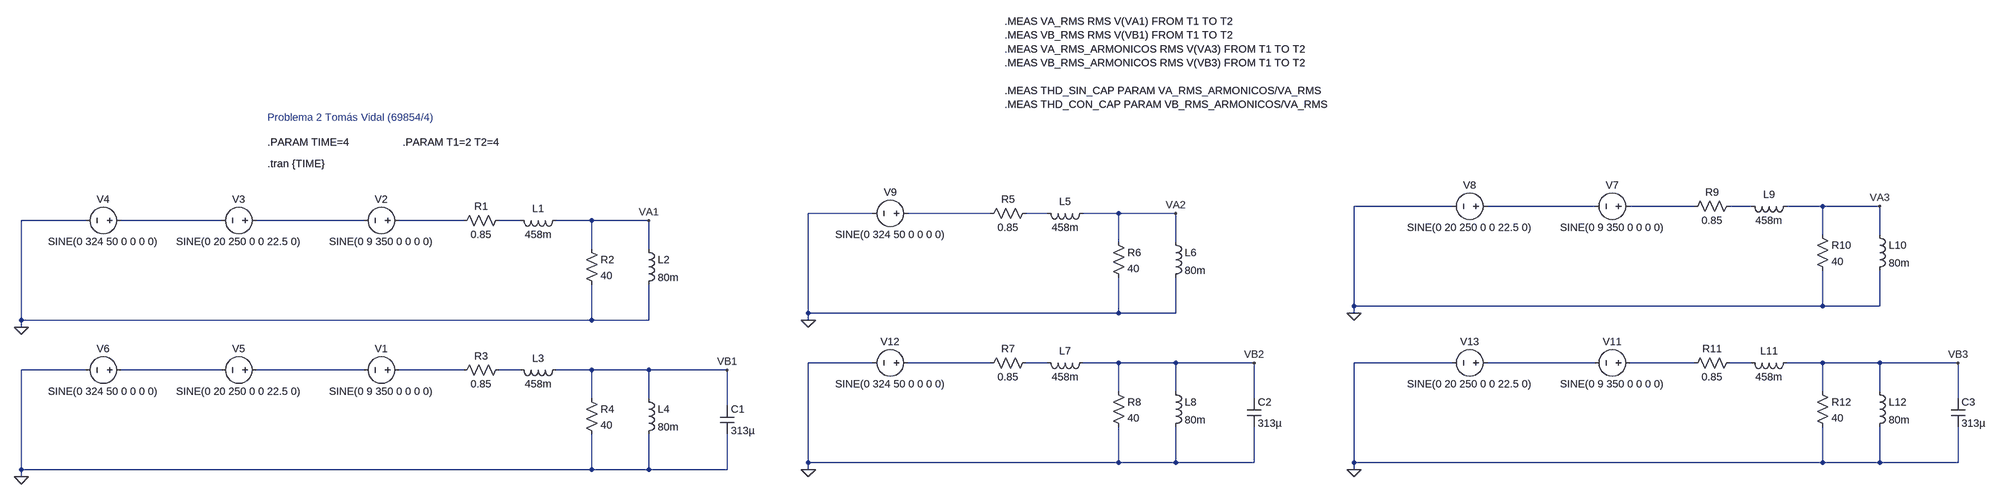
[diagram p0: schematic Problema2.asc]
Problema2.asc, the LTspice schematic file:
Version 4.1
SHEET 1 9112 6880
WIRE 3552 1152 3104 1152
WIRE 3872 1152 3632 1152
WIRE 4096 1152 3952 1152
WIRE 4224 1152 4176 1152
WIRE 4384 1152 4304 1152
WIRE 4512 1152 4384 1152
WIRE 1440 1168 1296 1168
WIRE 2288 1168 1520 1168
WIRE 2416 1168 2368 1168
WIRE 2576 1168 2496 1168
WIRE 2704 1168 2576 1168
WIRE -416 1184 -560 1184
WIRE -112 1184 -336 1184
WIRE 208 1184 -32 1184
WIRE 432 1184 288 1184
WIRE 560 1184 512 1184
WIRE 720 1184 640 1184
WIRE 848 1184 720 1184
WIRE 4384 1216 4384 1152
WIRE 4512 1216 4512 1152
WIRE 2576 1232 2576 1168
WIRE 2704 1232 2704 1168
WIRE 720 1248 720 1184
WIRE 848 1248 848 1184
WIRE 3104 1376 3104 1152
WIRE 4384 1376 4384 1296
WIRE 4384 1376 3104 1376
WIRE 4512 1376 4512 1296
WIRE 4512 1376 4384 1376
WIRE 1296 1392 1296 1168
WIRE 2576 1392 2576 1312
WIRE 2576 1392 1296 1392
WIRE 2704 1392 2704 1312
WIRE 2704 1392 2576 1392
WIRE 3104 1392 3104 1376
WIRE -560 1408 -560 1184
WIRE 720 1408 720 1328
WIRE 720 1408 -560 1408
WIRE 848 1408 848 1328
WIRE 848 1408 720 1408
WIRE 1296 1408 1296 1392
WIRE -560 1424 -560 1408
WIRE 1440 1504 1296 1504
WIRE 2288 1504 1520 1504
WIRE 2416 1504 2368 1504
WIRE 2576 1504 2496 1504
WIRE 2704 1504 2576 1504
WIRE 2880 1504 2704 1504
WIRE 3552 1504 3104 1504
WIRE 3872 1504 3632 1504
WIRE 4096 1504 3952 1504
WIRE 4224 1504 4176 1504
WIRE 4384 1504 4304 1504
WIRE 4512 1504 4384 1504
WIRE 4688 1504 4512 1504
WIRE -416 1520 -560 1520
WIRE -112 1520 -336 1520
WIRE 208 1520 -32 1520
WIRE 432 1520 288 1520
WIRE 560 1520 512 1520
WIRE 720 1520 640 1520
WIRE 848 1520 720 1520
WIRE 1024 1520 848 1520
WIRE 2576 1568 2576 1504
WIRE 2704 1568 2704 1504
WIRE 4384 1568 4384 1504
WIRE 4512 1568 4512 1504
WIRE 720 1584 720 1520
WIRE 848 1584 848 1520
WIRE 2880 1584 2880 1504
WIRE 4688 1584 4688 1504
WIRE 1024 1600 1024 1520
WIRE 1296 1728 1296 1504
WIRE 2576 1728 2576 1648
WIRE 2576 1728 1296 1728
WIRE 2704 1728 2704 1648
WIRE 2704 1728 2576 1728
WIRE 2880 1728 2880 1648
WIRE 2880 1728 2704 1728
WIRE 3104 1728 3104 1504
WIRE 4384 1728 4384 1648
WIRE 4384 1728 3104 1728
WIRE 4512 1728 4512 1648
WIRE 4512 1728 4384 1728
WIRE 4688 1728 4688 1648
WIRE 4688 1728 4512 1728
WIRE -560 1744 -560 1520
WIRE 720 1744 720 1664
WIRE 720 1744 -560 1744
WIRE 848 1744 848 1664
WIRE 848 1744 720 1744
WIRE 1024 1744 1024 1664
WIRE 1024 1744 848 1744
WIRE 1296 1744 1296 1728
WIRE 3104 1744 3104 1728
WIRE -560 1760 -560 1744
FLAG -560 1424 0
FLAG -560 1760 0
FLAG 848 1184 VA1
FLAG 1024 1520 VB1
FLAG 1296 1408 0
FLAG 2704 1168 VA2
FLAG 1296 1744 0
FLAG 2880 1504 VB2
FLAG 3104 1392 0
FLAG 4512 1152 VA3
FLAG 3104 1744 0
FLAG 4688 1504 VB3
SYMBOL res 528 1168 R90
WINDOW 0 0 56 VBottom 2
WINDOW 3 32 56 VTop 2
SYMATTR InstName R1
SYMATTR Value 0.85
SYMBOL ind 656 1168 R90
WINDOW 0 5 56 VBottom 2
WINDOW 3 32 56 VTop 2
SYMATTR InstName L1
SYMATTR Value 458m
SYMBOL res 704 1232 R0
SYMATTR InstName R2
SYMATTR Value 40
SYMBOL ind 832 1232 R0
SYMATTR InstName L2
SYMATTR Value 80m
SYMBOL cap 1008 1600 R0
SYMATTR InstName C1
SYMATTR Value 313µ
SYMBOL voltage 304 1184 R90
WINDOW 0 -32 56 VBottom 2
WINDOW 3 32 56 VTop 2
WINDOW 123 0 0 Left 0
WINDOW 39 0 0 Left 0
SYMATTR InstName V2
SYMATTR Value SINE(0 9 350 0 0 0 0)
SYMBOL voltage -16 1184 R90
WINDOW 0 -32 56 VBottom 2
WINDOW 3 32 56 VTop 2
WINDOW 123 0 0 Left 0
WINDOW 39 0 0 Left 0
SYMATTR InstName V3
SYMATTR Value SINE(0 20 250 0 0 22.5 0)
SYMBOL voltage -320 1184 R90
WINDOW 0 -32 56 VBottom 2
WINDOW 3 32 56 VTop 2
WINDOW 123 0 0 Left 0
WINDOW 39 0 0 Left 0
SYMATTR InstName V4
SYMATTR Value SINE(0 324 50 0 0 0 0)
SYMBOL res 528 1504 R90
WINDOW 0 0 56 VBottom 2
WINDOW 3 32 56 VTop 2
SYMATTR InstName R3
SYMATTR Value 0.85
SYMBOL ind 656 1504 R90
WINDOW 0 5 56 VBottom 2
WINDOW 3 32 56 VTop 2
SYMATTR InstName L3
SYMATTR Value 458m
SYMBOL res 704 1568 R0
SYMATTR InstName R4
SYMATTR Value 40
SYMBOL voltage 304 1520 R90
WINDOW 0 -32 56 VBottom 2
WINDOW 3 32 56 VTop 2
WINDOW 123 0 0 Left 0
WINDOW 39 0 0 Left 0
SYMATTR InstName V1
SYMATTR Value SINE(0 9 350 0 0 0 0)
SYMBOL voltage -16 1520 R90
WINDOW 0 -32 56 VBottom 2
WINDOW 3 32 56 VTop 2
WINDOW 123 0 0 Left 0
WINDOW 39 0 0 Left 0
SYMATTR InstName V5
SYMATTR Value SINE(0 20 250 0 0 22.5 0)
SYMBOL voltage -320 1520 R90
WINDOW 0 -32 56 VBottom 2
WINDOW 3 32 56 VTop 2
WINDOW 123 0 0 Left 0
WINDOW 39 0 0 Left 0
SYMATTR InstName V6
SYMATTR Value SINE(0 324 50 0 0 0 0)
SYMBOL ind 832 1568 R0
SYMATTR InstName L4
SYMATTR Value 80m
SYMBOL res 2384 1152 R90
WINDOW 0 0 56 VBottom 2
WINDOW 3 32 56 VTop 2
SYMATTR InstName R5
SYMATTR Value 0.85
SYMBOL ind 2512 1152 R90
WINDOW 0 5 56 VBottom 2
WINDOW 3 32 56 VTop 2
SYMATTR InstName L5
SYMATTR Value 458m
SYMBOL res 2560 1216 R0
SYMATTR InstName R6
SYMATTR Value 40
SYMBOL ind 2688 1216 R0
SYMATTR InstName L6
SYMATTR Value 80m
SYMBOL voltage 1536 1168 R90
WINDOW 0 -32 56 VBottom 2
WINDOW 3 32 56 VTop 2
WINDOW 123 0 0 Left 0
WINDOW 39 0 0 Left 0
SYMATTR InstName V9
SYMATTR Value SINE(0 324 50 0 0 0 0)
SYMBOL cap 2864 1584 R0
SYMATTR InstName C2
SYMATTR Value 313µ
SYMBOL res 2384 1488 R90
WINDOW 0 0 56 VBottom 2
WINDOW 3 32 56 VTop 2
SYMATTR InstName R7
SYMATTR Value 0.85
SYMBOL ind 2512 1488 R90
WINDOW 0 5 56 VBottom 2
WINDOW 3 32 56 VTop 2
SYMATTR InstName L7
SYMATTR Value 458m
SYMBOL res 2560 1552 R0
SYMATTR InstName R8
SYMATTR Value 40
SYMBOL voltage 1536 1504 R90
WINDOW 0 -32 56 VBottom 2
WINDOW 3 32 56 VTop 2
WINDOW 123 0 0 Left 0
WINDOW 39 0 0 Left 0
SYMATTR InstName V12
SYMATTR Value SINE(0 324 50 0 0 0 0)
SYMBOL ind 2688 1552 R0
SYMATTR InstName L8
SYMATTR Value 80m
SYMBOL res 4192 1136 R90
WINDOW 0 0 56 VBottom 2
WINDOW 3 32 56 VTop 2
SYMATTR InstName R9
SYMATTR Value 0.85
SYMBOL ind 4320 1136 R90
WINDOW 0 5 56 VBottom 2
WINDOW 3 32 56 VTop 2
SYMATTR InstName L9
SYMATTR Value 458m
SYMBOL res 4368 1200 R0
SYMATTR InstName R10
SYMATTR Value 40
SYMBOL ind 4496 1200 R0
SYMATTR InstName L10
SYMATTR Value 80m
SYMBOL voltage 3968 1152 R90
WINDOW 0 -32 56 VBottom 2
WINDOW 3 32 56 VTop 2
WINDOW 123 0 0 Left 0
WINDOW 39 0 0 Left 0
SYMATTR InstName V7
SYMATTR Value SINE(0 9 350 0 0 0 0)
SYMBOL voltage 3648 1152 R90
WINDOW 0 -32 56 VBottom 2
WINDOW 3 32 56 VTop 2
WINDOW 123 0 0 Left 0
WINDOW 39 0 0 Left 0
SYMATTR InstName V8
SYMATTR Value SINE(0 20 250 0 0 22.5 0)
SYMBOL cap 4672 1584 R0
SYMATTR InstName C3
SYMATTR Value 313µ
SYMBOL res 4192 1488 R90
WINDOW 0 0 56 VBottom 2
WINDOW 3 32 56 VTop 2
SYMATTR InstName R11
SYMATTR Value 0.85
SYMBOL ind 4320 1488 R90
WINDOW 0 5 56 VBottom 2
WINDOW 3 32 56 VTop 2
SYMATTR InstName L11
SYMATTR Value 458m
SYMBOL res 4368 1552 R0
SYMATTR InstName R12
SYMATTR Value 40
SYMBOL voltage 3968 1504 R90
WINDOW 0 -32 56 VBottom 2
WINDOW 3 32 56 VTop 2
WINDOW 123 0 0 Left 0
WINDOW 39 0 0 Left 0
SYMATTR InstName V11
SYMATTR Value SINE(0 9 350 0 0 0 0)
SYMBOL voltage 3648 1504 R90
WINDOW 0 -32 56 VBottom 2
WINDOW 3 32 56 VTop 2
WINDOW 123 0 0 Left 0
WINDOW 39 0 0 Left 0
SYMATTR InstName V13
SYMATTR Value SINE(0 20 250 0 0 22.5 0)
SYMBOL ind 4496 1552 R0
SYMATTR InstName L12
SYMATTR Value 80m
TEXT -8 952 Left 2 ;Problema 2 Tomás Vidal (69854/4)
TEXT -8 1008 Left 2 !.PARAM TIME=4
TEXT -8 1056 Left 2 !.tran {TIME}
TEXT 296 1008 Left 2 !.PARAM T1=2 T2=4
TEXT 2320 736 Left 2 !.MEAS VA_RMS RMS V(VA1) FROM T1 TO T2\n.MEAS VB_RMS RMS V(VB1) FROM T1 TO T2\n.MEAS VA_RMS_ARMONICOS RMS V(VA3) FROM T1 TO T2\n.MEAS VB_RMS_ARMONICOS RMS V(VB3) FROM T1 TO T2\n \n.MEAS THD_SIN_CAP PARAM VA_RMS_ARMONICOS/VA_RMS\n.MEAS THD_CON_CAP PARAM VB_RMS_ARMONICOS/VA_RMS

The netlist it stands for:
* Problema2.asc
R1 N009 N008 0.85
L1 VA1 N009 458m
R2 VA1 0 40
L2 VA1 0 80m
C1 VB1 0 313µ
V2 N008 N007 SINE(0 9 350 0 0 0 0)
V3 N007 N006 SINE(0 20 250 0 0 22.5 0)
V4 N006 0 SINE(0 324 50 0 0 0 0)
R3 N018 N017 0.85
L3 VB1 N018 458m
R4 VB1 0 40
V1 N017 N016 SINE(0 9 350 0 0 0 0)
V5 N016 N015 SINE(0 20 250 0 0 22.5 0)
V6 N015 0 SINE(0 324 50 0 0 0 0)
L4 VB1 0 80m
R5 N005 N004 0.85
L5 VA2 N005 458m
R6 VA2 0 40
L6 VA2 0 80m
V9 N004 0 SINE(0 324 50 0 0 0 0)
C2 VB2 0 313µ
R7 N011 N010 0.85
L7 VB2 N011 458m
R8 VB2 0 40
V12 N010 0 SINE(0 324 50 0 0 0 0)
L8 VB2 0 80m
R9 N003 N002 0.85
L9 VA3 N003 458m
R10 VA3 0 40
L10 VA3 0 80m
V7 N002 N001 SINE(0 9 350 0 0 0 0)
V8 N001 0 SINE(0 20 250 0 0 22.5 0)
C3 VB3 0 313µ
R11 N014 N013 0.85
L11 VB3 N014 458m
R12 VB3 0 40
V11 N013 N012 SINE(0 9 350 0 0 0 0)
V13 N012 0 SINE(0 20 250 0 0 22.5 0)
L12 VB3 0 80m
* Problema 2 Tomás Vidal (69854/4)
.PARAM TIME=4
.tran {TIME}
.PARAM T1=2 T2=4
.MEAS VA_RMS RMS V(VA1) FROM T1 TO T2
.MEAS VB_RMS RMS V(VB1) FROM T1 TO T2
.MEAS VA_RMS_ARMONICOS RMS V(VA3) FROM T1 TO T2
.MEAS VB_RMS_ARMONICOS RMS V(VB3) FROM T1 TO T2
.MEAS THD_SIN_CAP PARAM VA_RMS_ARMONICOS/VA_RMS
.MEAS THD_CON_CAP PARAM VB_RMS_ARMONICOS/VA_RMS
.backanno
.end

* Results of the author's LTspice run, read from the files saved beside the schematic
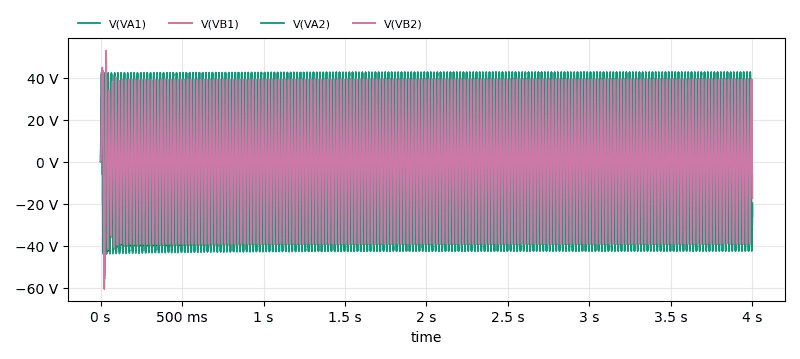
[diagram p1: Transient Analysis of Problema2.asc, plotted from the saved traces]
* Transient Analysis, 1 run:
*   V(VA1): min -44.02 V, max 42.69 V, average -207.6 mV, rms 30.04 V, last -20.93 V
*   V(VB1): min -60.6 V, max 52.2 V, average -149.6 mV, rms 27.8 V, last -17.34 V
*   V(VA2): min -42.69 V, max 42.66 V, average -29.46 mV, rms 30.03 V, last -19.84 V
*   V(VB2): min -59.33 V, max 52.93 V, average 28.4 mV, rms 27.8 V, last -17.32 V